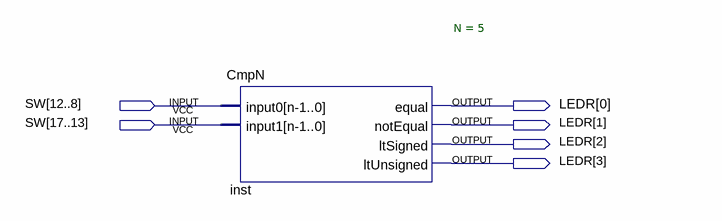
[diagram p0: schematic sheet]
// Quartus schematic CmpN_Demo.bdf as structural Verilog: 1 symbols, 6 pins
module CmpN_Demo (
  input  [17:8] SW,
  output [3:0] LEDR
);

  CmpN #(.N(5)) inst (
    .input0(SW[12:8]), .input1(SW[17:13]), .equal(LEDR[0]), .notEqual(LEDR[1]), .ltSigned(LEDR[2]),
    .ltUnsigned(LEDR[3]));
endmodule
